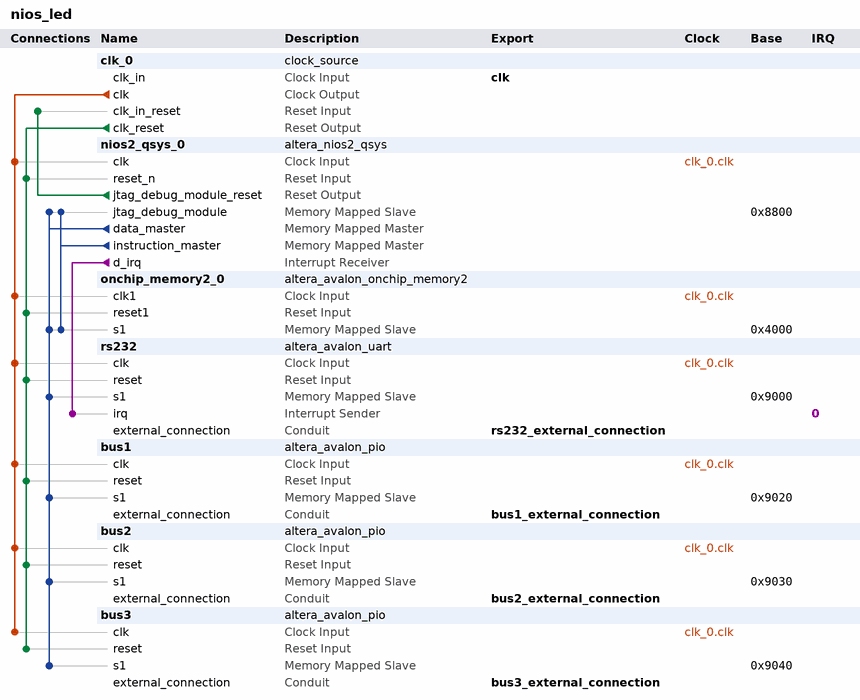
[diagram p0: system contents]
# Platform Designer (Qsys) system nios_led, Cyclone II EP2C20F484C7
# Parameters at their usual value, and those the tool derives, are not listed.
package require -exact qsys 13.0.1.99.1
create_system nios_led
set_project_property DEVICE_FAMILY {Cyclone II}
set_project_property DEVICE EP2C20F484C7

add_instance clk_0 clock_source 13.0
set_instance_parameter_value clk_0 clockFrequency 50000000

add_instance nios2_qsys_0 altera_nios2_qsys 13.0
set_instance_parameter_value nios2_qsys_0 resetSlave onchip_memory2_0.s1
set_instance_parameter_value nios2_qsys_0 mmu_TLBMissExcSlave None
set_instance_parameter_value nios2_qsys_0 exceptionSlave onchip_memory2_0.s1
set_instance_parameter_value nios2_qsys_0 breakSlave nios2_qsys_0.jtag_debug_module
set_instance_parameter_value nios2_qsys_0 impl Tiny
set_instance_parameter_value nios2_qsys_0 icache_size 4096

add_instance onchip_memory2_0 altera_avalon_onchip_memory2 13.0.1.99.1
set_instance_parameter_value onchip_memory2_0 dataWidth 32
set_instance_parameter_value onchip_memory2_0 dualPort false
set_instance_parameter_value onchip_memory2_0 initMemContent true
set_instance_parameter_value onchip_memory2_0 initializationFileName "C:\\altera\\13.0sp1\\nios_led\\software\\uart_handler\\mem_init\\nios_led_onchip_memory2_0"
set_instance_parameter_value onchip_memory2_0 memorySize 16384
set_instance_parameter_value onchip_memory2_0 useNonDefaultInitFile true

add_instance rs232 altera_avalon_uart 13.0.1.99.1
set_instance_parameter_value rs232 baud 115200
set_instance_parameter_value rs232 dataBits 8
set_instance_parameter_value rs232 fixedBaud true
set_instance_parameter_value rs232 parity NONE
set_instance_parameter_value rs232 stopBits 1

add_instance bus1 altera_avalon_pio 13.0.1.99.1
set_instance_parameter_value bus1 direction Output
set_instance_parameter_value bus1 width 8

add_instance bus2 altera_avalon_pio 13.0.1.99.1
set_instance_parameter_value bus2 direction Output
set_instance_parameter_value bus2 width 8

add_instance bus3 altera_avalon_pio 13.0.1.99.1
set_instance_parameter_value bus3 direction Output
set_instance_parameter_value bus3 width 8

# connections
add_connection clk_0.clk bus1.clk clock
add_connection clk_0.clk bus2.clk clock
add_connection clk_0.clk bus3.clk clock
add_connection clk_0.clk nios2_qsys_0.clk clock
add_connection clk_0.clk onchip_memory2_0.clk1 clock
add_connection clk_0.clk rs232.clk clock
add_connection clk_0.clk_reset bus1.reset reset
add_connection clk_0.clk_reset bus2.reset reset
add_connection clk_0.clk_reset bus3.reset reset
add_connection clk_0.clk_reset nios2_qsys_0.reset_n reset
add_connection clk_0.clk_reset onchip_memory2_0.reset1 reset
add_connection clk_0.clk_reset rs232.reset reset
add_connection nios2_qsys_0.jtag_debug_module_reset clk_0.clk_in_reset reset
add_connection nios2_qsys_0.data_master bus1.s1 avalon
set_connection_parameter_value nios2_qsys_0.data_master/bus1.s1 baseAddress 0x9020
add_connection nios2_qsys_0.data_master bus2.s1 avalon
set_connection_parameter_value nios2_qsys_0.data_master/bus2.s1 baseAddress 0x9030
add_connection nios2_qsys_0.data_master bus3.s1 avalon
set_connection_parameter_value nios2_qsys_0.data_master/bus3.s1 baseAddress 0x9040
add_connection nios2_qsys_0.data_master nios2_qsys_0.jtag_debug_module avalon
set_connection_parameter_value nios2_qsys_0.data_master/nios2_qsys_0.jtag_debug_module baseAddress 0x8800
add_connection nios2_qsys_0.data_master onchip_memory2_0.s1 avalon
set_connection_parameter_value nios2_qsys_0.data_master/onchip_memory2_0.s1 baseAddress 0x4000
add_connection nios2_qsys_0.data_master rs232.s1 avalon
set_connection_parameter_value nios2_qsys_0.data_master/rs232.s1 baseAddress 0x9000
add_connection nios2_qsys_0.instruction_master nios2_qsys_0.jtag_debug_module avalon
set_connection_parameter_value nios2_qsys_0.instruction_master/nios2_qsys_0.jtag_debug_module baseAddress 0x8800
add_connection nios2_qsys_0.instruction_master onchip_memory2_0.s1 avalon
set_connection_parameter_value nios2_qsys_0.instruction_master/onchip_memory2_0.s1 baseAddress 0x4000
add_connection nios2_qsys_0.d_irq rs232.irq interrupt
set_connection_parameter_value nios2_qsys_0.d_irq/rs232.irq irqNumber 0

# exported interfaces
add_interface clk clock sink
set_interface_property clk EXPORT_OF clk_0.clk_in
add_interface bus3_external_connection conduit end
set_interface_property bus3_external_connection EXPORT_OF bus3.external_connection
add_interface bus2_external_connection conduit end
set_interface_property bus2_external_connection EXPORT_OF bus2.external_connection
add_interface bus1_external_connection conduit end
set_interface_property bus1_external_connection EXPORT_OF bus1.external_connection
add_interface rs232_external_connection conduit end
set_interface_property rs232_external_connection EXPORT_OF rs232.external_connection

set_interconnect_requirement {$system} qsys_mm.clockCrossingAdapter HANDSHAKE
set_interconnect_requirement {$system} qsys_mm.maxAdditionalLatency 1

save_system nios_led.qsys
